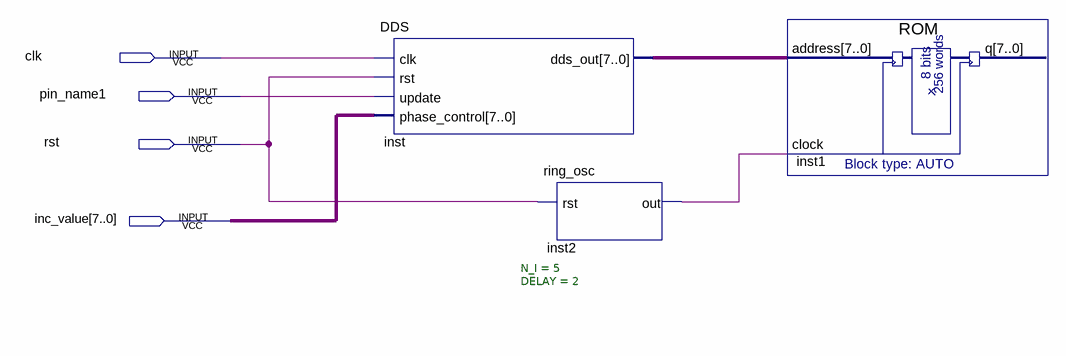
[diagram p0: schematic sheet]
// Quartus schematic DDS_ROM.bdf as structural Verilog: 3 symbols, 4 pins
module DDS_ROM (
  input  clk,
  input  pin_name1,
  input  rst,
  input  [7:0] inc_value
);

  wire inst2_out;
  wire [7:0] inst_dds_out;

  DDS inst (.clk(clk), .rst(rst), .update(pin_name1), .phase_control(inc_value), .dds_out(inst_dds_out));
  ring_osc #(.N_I(5), .DELAY(2)) inst2 (.rst(rst), .out(inst2_out));
  ROM inst1 (.address(inst_dds_out), .clock(inst2_out));  // open: q
endmodule
